# EAGLE design SensorHub (EAGLE 9.6.2)
CNAME: https://github.com/thomo/anycubic-i3-mega; CREVISION: v1.0; DESIGNER: ThoMo
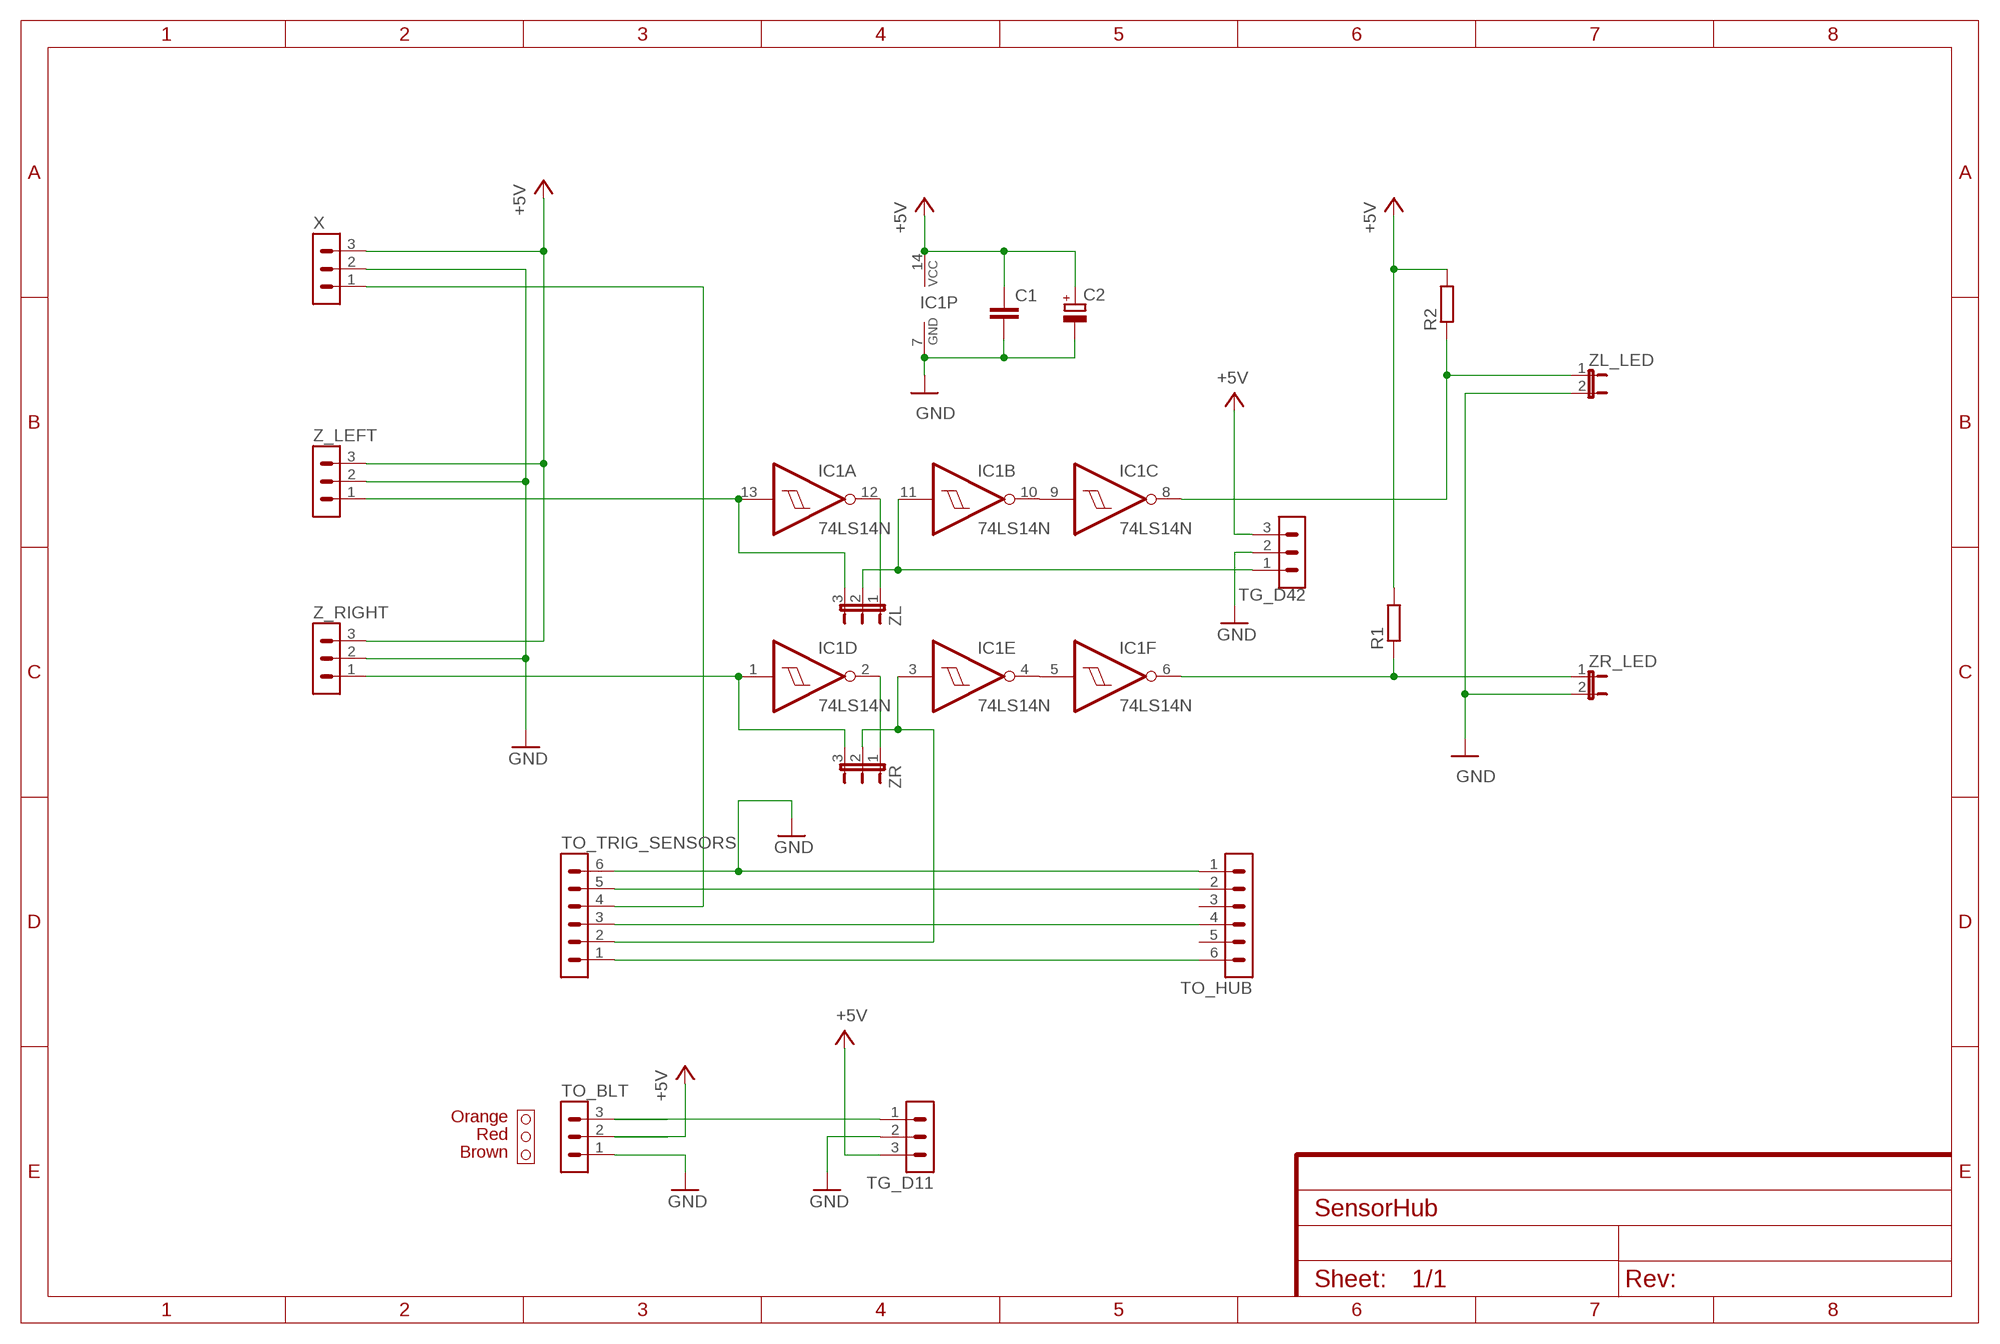
[diagram p0: schematic, sheet 1]

## Parts
C1  C-EU050-030X075  [C050-030X075]
C2  CPOL-EUE3.5-8  [E3,5-8]
IC1  74LS14N  [DIL14]
R1  R-EU_0207/10  [0207/10]
R2  R-EU_0207/10  [0207/10]
TG_D11  JST-3PTOP  [XH-A-TOP-3P]
TG_D42  JST-3PTOP  [XH-A-TOP-3P]
TO_BLT  JST-3PTOP  [XH-A-TOP-3P]
TO_HUB  JST-6PPH-TOP  [PH-TOP-6P]
TO_TRIG_SENSORS  JST-6PPH-TOP  [PH-TOP-6P]
X  JST-3PTOP  [XH-A-TOP-3P]
Z_LEFT  JST-3PTOP  [XH-A-TOP-3P]
Z_RIGHT  JST-3PTOP  [XH-A-TOP-3P]
ZL  JP2E  [JP2]
ZL_LED  ZL LED  JP1E  [JP1]
ZR  JP2E  [JP2]
ZR_LED  ZR LED  JP1E  [JP1]

## Nets
+5V: C1.1 C2.+ IC1.14(P:VCC) R1.2 R2.2 TG_D11.3 TG_D42.3 TO_BLT.2 X.3 Z_LEFT.3 Z_RIGHT.3
GND: C1.2 C2.- IC1.7(P:GND) TG_D11.2 TG_D42.2 TO_BLT.1 TO_HUB.1 TO_TRIG_SENSORS.6 X.2 Z_LEFT.2 Z_RIGHT.2 ZL_LED.2 ZR_LED.2
N$2: IC1.6(F:O) R1.1 ZR_LED.1
N$3: IC1.13(A:I) Z_LEFT.1 ZL.3
N$4: IC1.1(D:I) Z_RIGHT.1 ZR.3
N$5: TO_HUB.4 TO_TRIG_SENSORS.3
N$6: TO_HUB.2 TO_TRIG_SENSORS.5
N$7: IC1.11(B:I) TG_D42.1 ZL.2
N$8: TO_HUB.6 TO_TRIG_SENSORS.1
N$9: IC1.9(C:I) IC1.10(B:O)
N$10: TO_TRIG_SENSORS.4 X.1
N$11: IC1.4(E:O) IC1.5(F:I)
N$12: IC1.12(A:O) ZL.1
N$13: TG_D11.1 TO_BLT.3
N$14: IC1.2(D:O) ZR.1
N$15: IC1.3(E:I) TO_TRIG_SENSORS.2 ZR.2
TG_D42: IC1.8(C:O) R2.1 ZL_LED.1
Unconnected: TO_HUB.3 TO_HUB.5

## Notes on the sheet
- Orange
- Red
- Brown

## Library data of the parts
C1 = rcl:C-EU: CAPACITOR, European symbol; SPICEPREFIX: C
C2 = rcl:CPOL-EU: POLARIZED CAPACITOR, European symbol; SPICEPREFIX: C
IC1 = 74xx-eu:74*14: Hex schmitt trigger INVERTER
R1 R2 = rcl:R-EU_: RESISTOR, European symbol; SPICEPREFIX: R
TG_D11 TG_D42 TO_BLT X Z_LEFT Z_RIGHT = thomo-jst:JST-3P: 3 pin JST connector
TO_HUB TO_TRIG_SENSORS = thomo-jst:JST-6P: 6pin JST connector
ZL ZR = jumper:JP2E: JUMPER
ZL_LED ZR_LED = jumper:JP1E: JUMPER

## Board
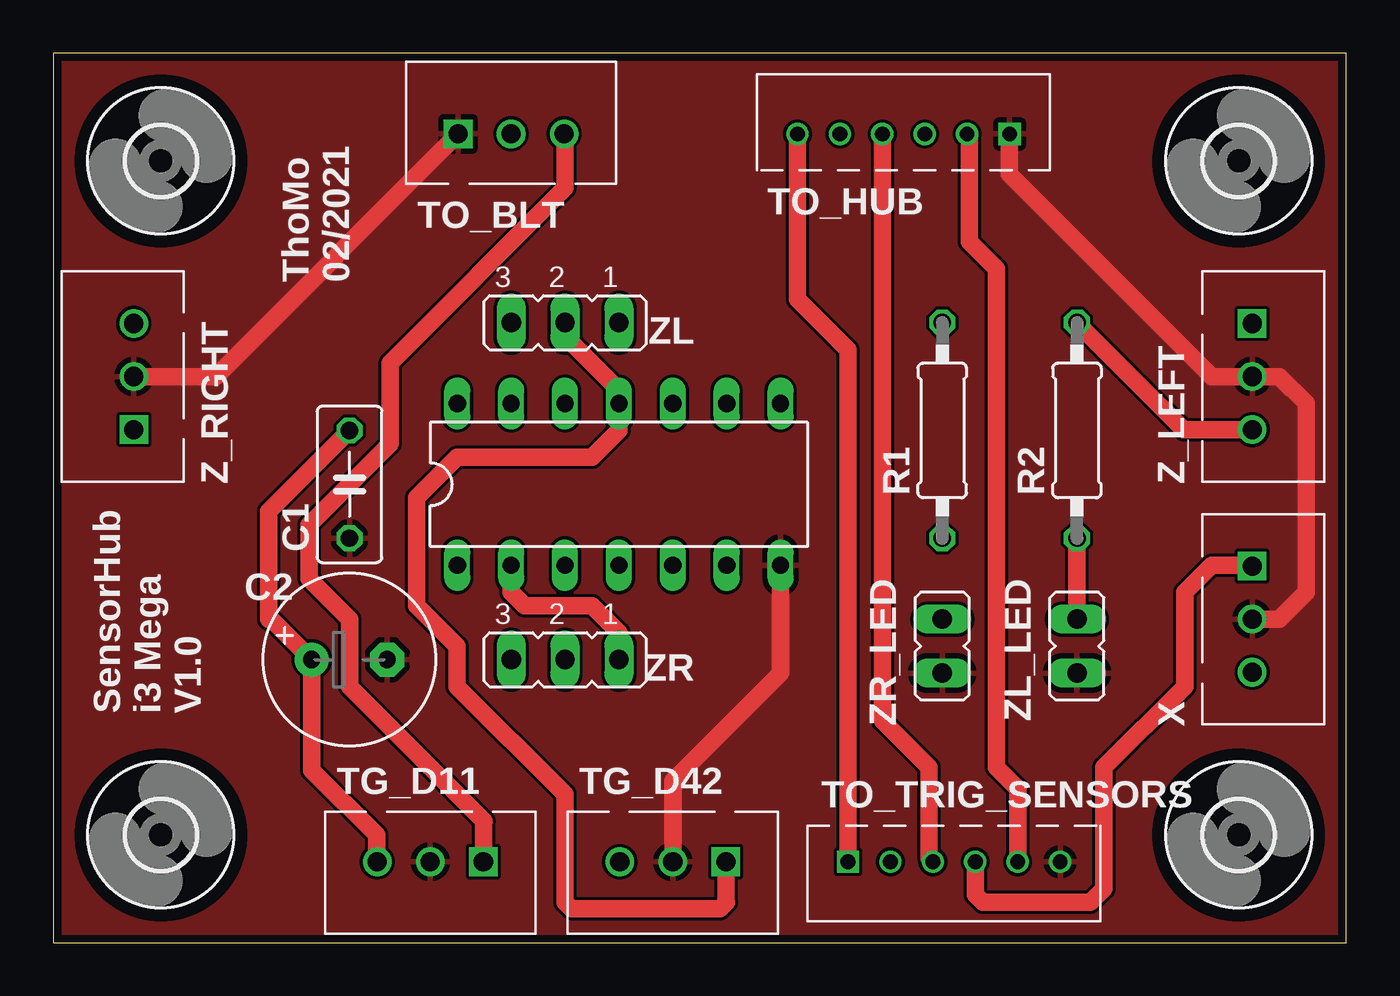
[diagram p1: board, top side]
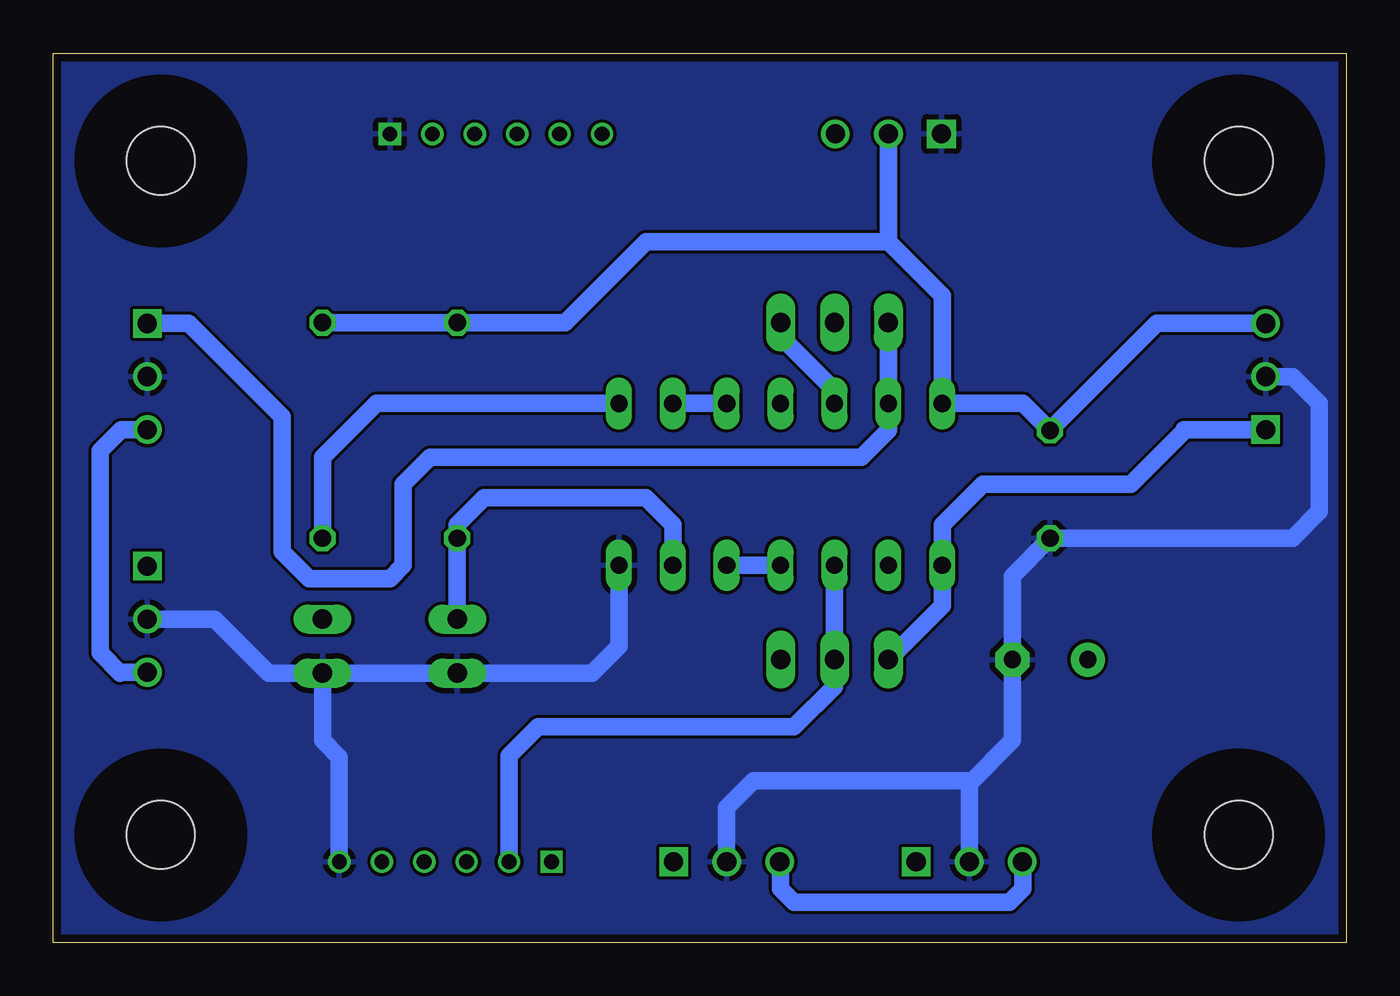
[diagram p2: board, bottom side, seen from below]

Size 60.96 x 41.91 mm. Coordinates in mm from the lower left corner, seen from the top.
Outline: 0,0 60.96,0 60.96,41.91 0,41.91 0,0
Copper layers (1*16): Top 0.035559375mm / dielectric 1.6mm / Bottom 0.035559375mm
Design rules "oshpark-2layer": minimum track width 6mil, minimum drill 10mil, track to track 6mil, track to pad 6mil, pad to pad 6mil, via to via 6mil, smd to smd 6mil, copper to edge 15mil, drill to drill 6mil, minimum pad ring 5mil, minimum via ring 5mil, stop-mask expansion 2.5mil, vias tented up to drill 0mil, thermal gap 10mil

### Footprints (pad centres in the part's own frame; a part is rotated, then mirrored left to right if it is on the bottom)
C050-030X075 = drill 0.813 octagon: 1 -2.54,0; 2 2.54,0
E3,5-8 = drill 0.813 pad 1.6: + -1.778,0 | drill 0.813 pad 1.6 octagon: - 1.778,0
DIL14 = drill 0.813 long: 1 -7.62,-3.81; 2 -5.08,-3.81; 3 -2.54,-3.81; 4 0,-3.81; 5 2.54,-3.81; 6 5.08,-3.81; 7 7.62,-3.81; 8 7.62,3.81; 9 5.08,3.81; 10 2.54,3.81; 11 0,3.81; 12 -2.54,3.81; 13 -5.08,3.81; 14 -7.62,3.81
0207/10 = drill 0.813 octagon: 1 -5.08,0; 2 5.08,0
XH-A-TOP-3P = drill 0.9 square: 1 -2.5,0 | drill 0.9: 2 0,0; 3 2.5,0
PH-TOP-6P = drill 0.7 square: 1 0,0 | drill 0.7: 2 2,0; 3 4,0; 4 6,0; 5 8,0; 6 10,0
3,2 = hole 3.2: 0,0
JP2 = drill 0.914 long: 1 -2.54,0; 2 0,0; 3 2.54,0
JP1 = drill 0.914 long: 1 0,-1.27; 2 0,1.27

### Placement (x,y rotation side)
C1  13.97,21.59 270 top
C2  13.97,13.34 0 top
IC1  26.67,21.59 0 top
R1  41.91,24.13 90 top
R2  48.26,24.13 90 top
TG_D11  17.78,3.81 180 top
TG_D42  29.21,3.81 180 top
TO_BLT  21.59,38.1 0 top
TO_HUB  45.09,38.1 180 top
TO_TRIG_SENSORS  37.47,3.81 0 top
U$1  [3,2]  5.08,5.08 0 top
U$2  [3,2]  55.88,5.08 0 top
U$3  [3,2]  55.88,36.83 0 top
U$4  [3,2]  5.08,36.83 0 top
X  56.52,15.24 270 top
Z_LEFT  56.52,26.67 270 top
Z_RIGHT  3.81,26.67 90 top
ZL  24.13,29.21 180 top
ZL_LED  48.26,13.97 180 top
ZR  24.13,13.34 180 top
ZR_LED  41.91,13.97 180 top

### Tracks (layer width: path | path; a pad name or v marks a point on that pad's centre or on a via)
+5V
  Top 0.813: C1.1 10.16,20.32 10.16,15.24 10.29,15.24 C2.+ 12.19,8.13 15.24,5.08 15.24,3.85 TG_D11.3 | Z_LEFT.3 53.3,24.17 R2.2
  Bottom 0.813: R2.2 R1.2 36.83,29.21 33.02,33.02 21.59,33.02 | 21.59,33.02 19.05,30.48 IC1.14 15.24,25.4 C1.1 8.93,29.17 Z_RIGHT.3 | TO_BLT.2 21.59,33.02 | X.3 57.74,12.74 57.78,12.7 58.74,13.65 58.74,23.18 57.74,24.17 Z_LEFT.3 | TG_D42.3 26.67,3.77 26.67,2.54 26.04,1.91 15.88,1.91 15.24,2.54 15.24,3.77 TG_D11.3
GND
  Top 0.813: IC1.7 34.29,12.7 29.21,7.62 TG_D42.2 | X.2 57.78,15.24 59.05,16.51 59.05,25.4 57.78,26.67 Z_LEFT.2 54.61,26.67 45.09,36.2 TO_HUB.1 | TO_BLT.1 7.66,26.67 Z_RIGHT.2
  Bottom 0.813: ZL_LED.2 ZR_LED.2 35.56,12.7 34.29,13.97 IC1.7 | TO_TRIG_SENSORS.6 47.47,8.73 48.26,9.53 ZL_LED.2 | ZL_LED.2 50.8,12.7 53.34,15.24 X.2 | 17.78,7.49 TG_D11.2 | 17.78,7.49 15.75,9.53 C2.- 15.75,17.27 C1.2 2.54,19.05 1.27,20.32 1.27,25.4 2.54,26.67 Z_RIGHT.2 | 17.78,7.49 17.91,7.62 27.94,7.62 29.21,6.35 TG_D42.2
  pour Top: 0,41.91 0,0 60.96,0 60.96,41.91
  pour Bottom: 0,41.91 0,0 60.96,0 60.96,41.91
N$2
  Bottom 0.813: ZR_LED.1 R1.1 41.91,19.68 40.64,20.95 33.02,20.95 31.75,19.68 IC1.6
N$3
  Bottom 0.813: ZL.3 IC1.13 21.59,24.13 22.86,22.86 43.18,22.86 44.45,21.59 44.45,17.78 45.09,17.14 48.9,17.14 50.16,18.41 50.16,24.77 54.57,29.17 Z_LEFT.1
N$4
  Bottom 0.813: ZR.3 19.05,15.88 IC1.1 19.05,19.68 17.14,21.59 10.16,21.59 7.62,24.13 7.66,24.17 Z_RIGHT.1
N$5
  Top 0.813: TO_HUB.4 39.09,10.45 41.27,8.26 41.27,4 TO_TRIG_SENSORS.3
N$6
  Top 0.813: TO_TRIG_SENSORS.5 45.47,7.24 44.45,8.26 44.45,31.75 43.18,33.02 43.18,38.01 TO_HUB.2
N$7
  Top 0.813: ZL.2 24.13,28.57 26.67,26.04 IC1.11 26.67,24.13 25.4,22.86 19.05,22.86 17.14,20.95 17.14,15.88 19.05,13.97 19.05,12.06 24.13,6.99 24.13,1.91 24.45,1.59 31.43,1.59 31.75,1.91 31.71,1.95 TG_D42.1
N$8
  Top 0.813: TO_TRIG_SENSORS.1 37.47,27.94 35.09,30.32 TO_HUB.6
N$9
  Bottom 0.813: IC1.10 IC1.9
N$10
  Top 0.813: TO_TRIG_SENSORS.4 43.47,2.25 43.81,1.91 48.9,1.91 49.53,2.54 49.53,8.26 53.34,12.06 53.34,16.51 54.61,17.78 56.48,17.78 X.1
N$11
  Bottom 0.813: IC1.5 IC1.4
N$12
  Bottom 0.813: IC1.12 24.13,26.04 26.67,28.57 ZL.1
N$13
  Top 0.813: TO_BLT.3 24.13,38.06 24.13,35.56 15.88,27.3 15.88,23.5 12.06,19.68 12.06,17.14 13.97,15.24 13.97,12.06 20.32,5.71 20.28,5.67 TG_D11.1
N$14
  Top 0.813: IC1.2 21.59,16.51 22.23,15.88 25.4,15.88 26.67,14.61 ZR.1
N$15
  Bottom 0.813: IC1.3 ZR.2 24.13,12.06 26.04,10.16 38.1,10.16 39.47,8.79 TO_TRIG_SENSORS.2
TG_D42
  Top 0.813: ZL_LED.1 R2.1
  Bottom 0.813: R2.1 48.26,22.86 45.72,25.4 IC1.8

### Text on the board
tPlace: ThoMo / 02/2021 | SensorHub / i3 Mega | V1.0